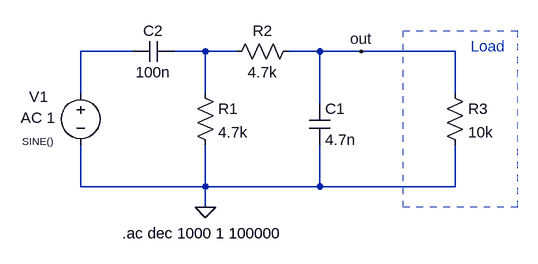
[diagram p0: schematic Bandpass_AFSK_1200.asc]
Bandpass_AFSK_1200.asc, the LTspice schematic file:
Version 4
SHEET 1 880 680
WIRE 48 112 -32 112
WIRE 160 112 112 112
WIRE 208 112 160 112
WIRE 336 112 288 112
WIRE 400 112 336 112
WIRE 544 112 400 112
WIRE -32 176 -32 112
WIRE 160 176 160 112
WIRE 544 176 544 112
WIRE 336 192 336 112
WIRE -32 320 -32 256
WIRE 160 320 160 256
WIRE 160 320 -32 320
WIRE 336 320 336 256
WIRE 336 320 160 320
WIRE 544 320 544 256
WIRE 544 320 336 320
WIRE 160 352 160 320
FLAG 160 352 0
FLAG 400 112 out
SYMBOL res 144 160 R0
SYMATTR InstName R1
SYMATTR Value 4.7k
SYMBOL cap 320 192 R0
SYMATTR InstName C1
SYMATTR Value 4.7n
SYMBOL voltage -32 160 R0
WINDOW 123 -92 54 Left 2
WINDOW 39 0 0 Left 2
WINDOW 3 -90 90 Left 1
WINDOW 0 -79 22 Left 2
SYMATTR Value2 AC 1
SYMATTR Value SINE()
SYMATTR InstName V1
SYMBOL res 192 128 R270
WINDOW 0 32 56 VTop 2
WINDOW 3 0 56 VBottom 2
SYMATTR InstName R2
SYMATTR Value 4.7k
SYMBOL cap 112 96 R90
WINDOW 0 0 32 VBottom 2
WINDOW 3 32 32 VTop 2
SYMATTR InstName C2
SYMATTR Value 100n
SYMBOL res 528 160 R0
SYMATTR InstName R3
SYMATTR Value 10k
TEXT 32 392 Left 2 !.ac dec 1000 1 100000
TEXT 568 104 Left 2 ;Load
RECTANGLE Normal 640 352 464 80 2

The netlist it stands for:
* Bandpass_AFSK_1200.asc
R1 N002 0 4.7k
C1 out 0 4.7n
V1 N001 0 SINE() AC 1
R2 N002 out 4.7k
C2 N002 N001 100n
R3 out 0 10k
.ac dec 1000 1 100000
* Load
.backanno
.end